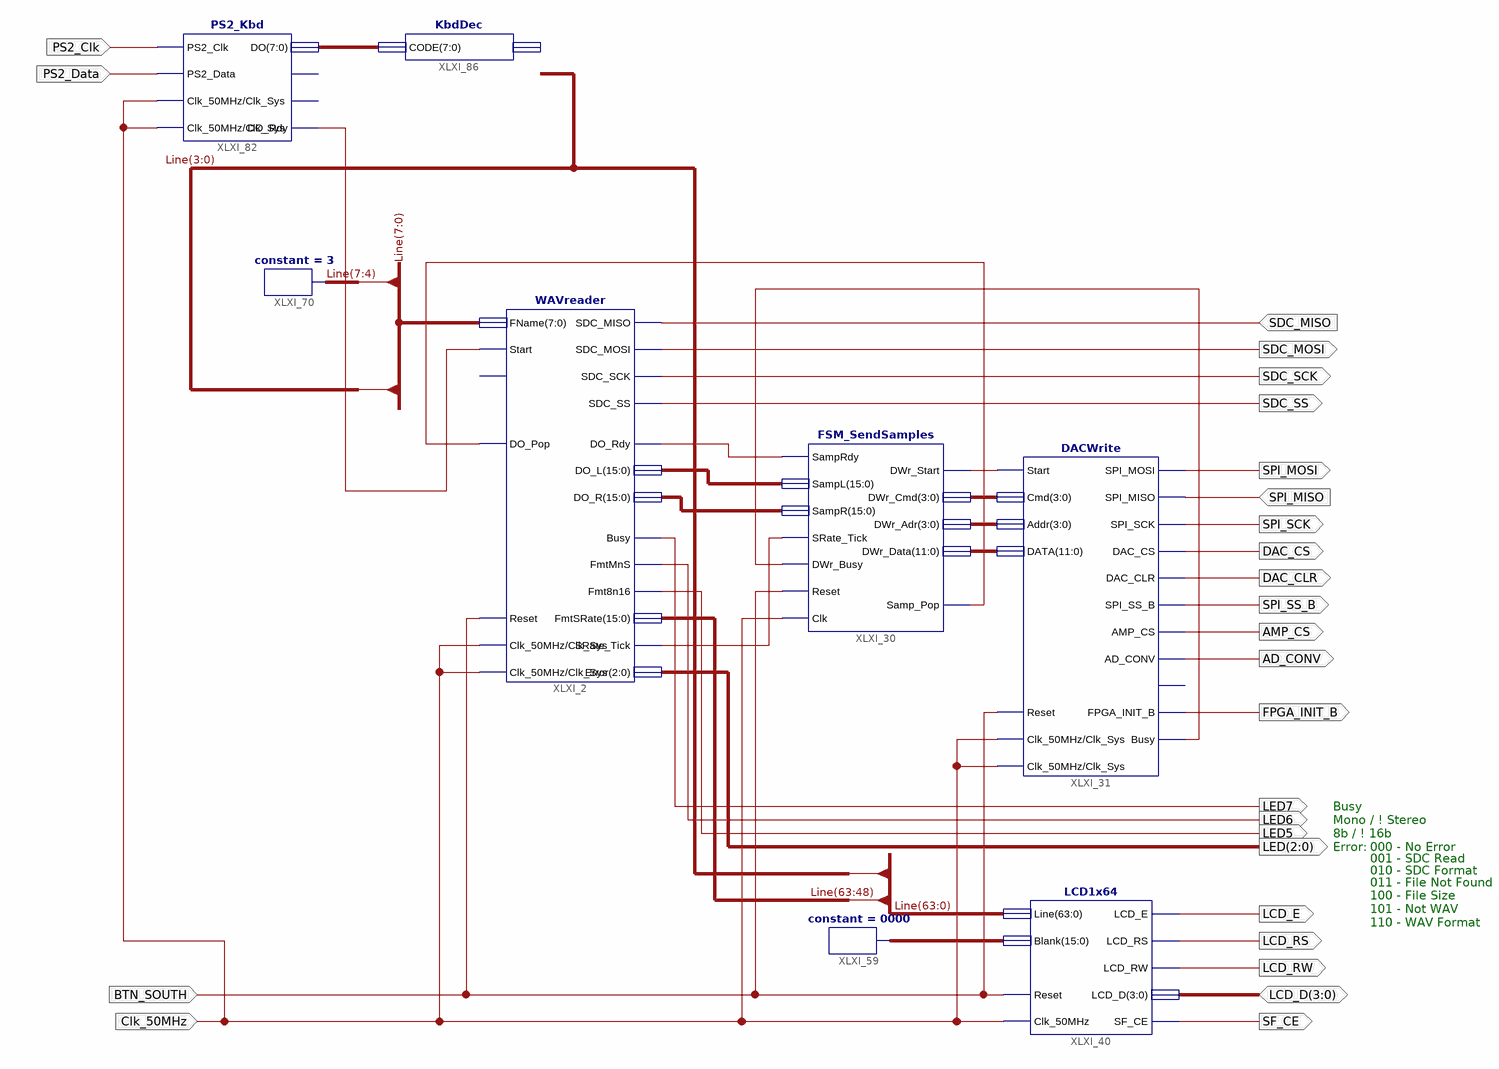
[diagram p0: schematic sheet 1]
// Xilinx ISE schematic Test_WAVreader.sch (spartan3e) as structural Verilog: 8 symbols, 26 ports
module Test_WAVreader (
  input  SPI_MISO,
  input  Clk_50MHz,
  input  SDC_MISO,
  input  BTN_SOUTH,
  input  PS2_Clk,
  input  PS2_Data,
  inout  [3:0] LCD_D,
  output SPI_SS_B,
  output AMP_CS,
  output AD_CONV,
  output FPGA_INIT_B,
  output SPI_MOSI,
  output SPI_SCK,
  output DAC_CS,
  output DAC_CLR,
  output LCD_E,
  output LCD_RS,
  output LCD_RW,
  output SF_CE,
  output [2:0] LED,
  output LED5,
  output LED6,
  output LED7,
  output SDC_SS,
  output SDC_SCK,
  output SDC_MOSI
);

  wire XLXN_377, XLXN_383, XLXN_388, XLXN_395, XLXN_396, XLXN_557;
  wire [3:0] XLXN_389, XLXN_390;
  wire [7:0] XLXN_553;
  wire [11:0] XLXN_391;
  wire [15:0] XLXN_378, XLXN_379, XLXN_549;
  wire [63:0] Line;

  FSM_SendSamples XLXI_30 (
    .DWr_Busy(XLXN_396), .SampRdy(XLXN_377), .SampL(XLXN_378), .SampR(XLXN_379), .SRate_Tick(XLXN_383),
    .Reset(BTN_SOUTH), .Clk(Clk_50MHz), .DWr_Start(XLXN_388), .DWr_Cmd(XLXN_389), .DWr_Adr(XLXN_390),
    .DWr_Data(XLXN_391), .Samp_Pop(XLXN_395));
  DACWrite XLXI_31 (
    .Reset(BTN_SOUTH), .Start(XLXN_388), .SPI_MISO(SPI_MISO), .Cmd(XLXN_389), .Addr(XLXN_390),
    .DATA(XLXN_391), .DAC_CLR(DAC_CLR), .DAC_CS(DAC_CS), .SPI_MOSI(SPI_MOSI), .SPI_SCK(SPI_SCK),
    .SPI_SS_B(SPI_SS_B), .AMP_CS(AMP_CS), .AD_CONV(AD_CONV), .FPGA_INIT_B(FPGA_INIT_B), .Busy(XLXN_396),
    .Clk_50MHz(Clk_50MHz), .Clk_Sys(Clk_50MHz));  // open: SF_CE0
  constant #(.CValue("0000")) XLXI_59 (.O(XLXN_549));
  LCD1x64 XLXI_40 (
    .Clk_50MHz(Clk_50MHz), .Reset(BTN_SOUTH), .Line(Line), .Blank(XLXN_549), .LCD_D(LCD_D), .LCD_E(LCD_E),
    .LCD_RW(LCD_RW), .LCD_RS(LCD_RS), .SF_CE(SF_CE));
  constant #(.CValue("3")) XLXI_70 (.O(Line[7:4]));
  WAVreader XLXI_2 (
    .FName(Line[7:0]), .Start(XLXN_557), .SDC_MOSI(SDC_MOSI), .SDC_SCK(SDC_SCK), .SDC_SS(SDC_SS),
    .SDC_MISO(SDC_MISO), .DO_Rdy(XLXN_377), .DO_L(XLXN_378), .DO_R(XLXN_379), .DO_Pop(XLXN_395), .Busy(LED7),
    .FmtMnS(LED6), .Fmt8n16(LED5), .FmtSRate(Line[63:48]), .SRate_Tick(XLXN_383), .Error(LED),
    .Reset(BTN_SOUTH), .Clk_50MHz(Clk_50MHz), .Clk_Sys(Clk_50MHz));  // open: Abort
  PS2_Kbd XLXI_82 (
    .PS2_Clk(PS2_Clk), .PS2_Data(PS2_Data), .Clk_50MHz(Clk_50MHz), .DO_Rdy(XLXN_557), .DO(XLXN_553),
    .Clk_Sys(Clk_50MHz));  // open: E0, F0
  KbdDec XLXI_86 (.CODE(XLXN_553), .DEC(Line[3:0]));

  // Notes on the sheet:
  //   Busy
  //   Mono / ! Stereo
  //   8b / ! 16b
  //   Error:
  //   000 - No Error
  //   001 - SDC Read
  //   010 - SDC Format
  //   011 - File Not Found
  //   100 - File Size
  //   101 - Not WAV
  //   110 - WAV Format
endmodule
